# EAGLE design TXn_v1.2_bottomonly (EAGLE 8.6.2)
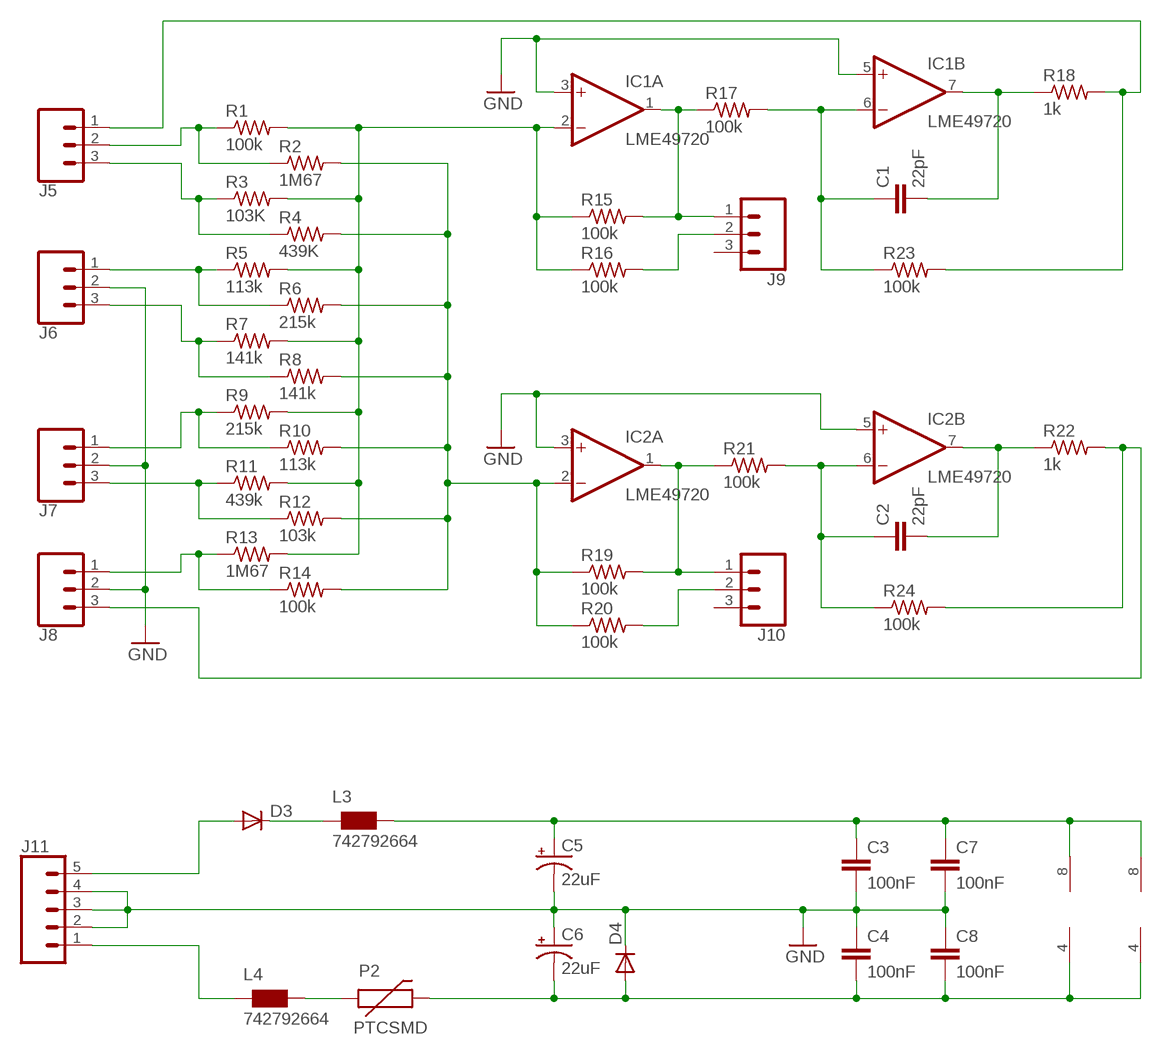
[diagram p0: schematic, sheet 1]

## Parts
C1  22pF  CAP0603-CAP  [0603-CAP]
C2  22pF  CAP0603-CAP  [0603-CAP]
C3  100nF  CAP0603-CAP  [0603-CAP]
C4  100nF  CAP0603-CAP  [0603-CAP]
C5  22uF  CPOL-USB  [PANASONIC_B]
C6  22uF  CPOL-USB  [PANASONIC_B]
C7  100nF  CAP0603-CAP  [0603-CAP]
C8  100nF  CAP0603-CAP  [0603-CAP]
D3  DIODE-SOD123  [SOD123]
D4  DIODE-SOD123  [SOD123]
IC1  LME49720  TL072D  [SO08]
IC2  LME49720  TL072D  [SO08]
J5  CONN_031X03_NO_SILK  [1X03_NO_SILK]
J6  CONN_031X03_NO_SILK  [1X03_NO_SILK]
J7  CONN_031X03_NO_SILK  [1X03_NO_SILK]
J8  CONN_031X03_NO_SILK  [1X03_NO_SILK]
J9  CONN_031X03_NO_SILK  [1X03_NO_SILK]
J10  CONN_031X03_NO_SILK  [1X03_NO_SILK]
J11  CONN_05NO_SILK  [1X05_NO_SILK]
L3  742792664  WE-CBF_0603  [0603]
L4  742792664  WE-CBF_0603  [0603]
P2  PTCSMD  [PTC-1206]
R1  100k  R-US_R0603  [R0603]
R2  1M67  R-US_R0603  [R0603]
R3  103K  R-US_R0603  [R0603]
R4  439K  R-US_R0603  [R0603]
R5  113k  R-US_R0603  [R0603]
R6  215k  R-US_R0603  [R0603]
R7  141k  R-US_R0603  [R0603]
R8  141k  R-US_R0603  [R0603]
R9  215k  R-US_R0603  [R0603]
R10  113k  R-US_R0603  [R0603]
R11  439k  R-US_R0603  [R0603]
R12  103k  R-US_R0603  [R0603]
R13  1M67  R-US_R0603  [R0603]
R14  100k  R-US_R0603  [R0603]
R15  100k  R-US_R0603  [R0603]
R16  100k  R-US_R0603  [R0603]
R17  100k  R-US_R0603  [R0603]
R18  1k  R-US_R0603  [R0603]
R19  100k  R-US_R0603  [R0603]
R20  100k  R-US_R0603  [R0603]
R21  100k  R-US_R0603  [R0603]
R22  1k  R-US_R0603  [R0603]
R23  100k  R-US_R0603  [R0603]
R24  100k  R-US_R0603  [R0603]

## Nets
BMIX: IC2.2(A:-IN) R2.2 R4.2 R6.2 R8.2 R10.2 R12.2 R14.2 R19.1 R20.1
BOUT: J8.3 R22.2 R24.2
GND: C3.2 C4.1 C5.- C6.+ C7.2 C8.1 D4.C IC1.3(A:+IN) IC1.5(B:+IN) IC2.3(A:+IN) IC2.5(B:+IN) J6.2 J7.2 J8.2 J11.2 J11.3 J11.4
N$3: J5.2 R1.1 R2.1
N$4: J5.3 R3.1 R4.1
N$5: J6.1 R5.1 R6.1
N$6: J6.3 R7.1 R8.1
N$7: J7.3 R11.1 R12.1
N$8: J8.1 R13.1 R14.1
N$10: J7.1 R9.1 R10.1
N$18: IC2.1(A:OUT) J10.1 R19.2 R21.1
N$21: C2.1 IC2.6(B:-IN) R21.2 R24.1
N$23: IC1.1(A:OUT) J9.1 R15.2 R17.1
N$24: C1.1 IC1.6(B:-IN) R17.2 R23.1
N$25: C2.2 IC2.7(B:OUT) R22.1
N$26: J9.2 R16.2
N$27: C1.2 IC1.7(B:OUT) R18.1
N$30: J10.2 R20.2
N$33: D3.C L3.1
N$34: L4.2 P2.1
TMIX: IC1.2(A:-IN) R1.2 R3.2 R5.2 R7.2 R9.2 R11.2 R13.2 R15.1 R16.1
TOUT: J5.1 R18.2 R23.2
VCC: C3.1 C5.+ C7.1 IC1.8(P:V+) IC2.8(P:V+) L3.2
VCC1: D3.A J11.5
VEE: C4.2 C6.- C8.2 D4.A IC1.4(P:V-) IC2.4(P:V-) P2.2
VEE1: J11.1 L4.1
Unconnected: J9.3 J10.3

## Library data of the parts
C1-C4 C7 C8 = SparkFun-Passives:CAP: Capacitor Standard 0603 ceramic capacitor, and 0.1" leaded capacitor.
C5 C6 = rcl:CPOL-US: POLARIZED CAPACITOR, American symbol; SPICEPREFIX: C
D3 D4 = diode:DIODE-: DIODE
IC1 = linear:TL072: OP AMP; SPICEPREFIX: J
IC2 = linear:TL072: OP AMP
J5-J10 = SparkFun-Connectors:CONN_03: Header 3 Standard 3-pin 0.1" header. Use with straight break away headers (SKU : PRT-00116), right angle break away headers (PRT-00553), swiss pins (PRT-00743), machine pins (PRT-00117), and female headers (PRT-00115). Molex polarized connector foot print use with SKU : PRT-08232 with associated crimp pins and housings.
J11 = SparkFun-Connectors:CONN_05: Header 5 Standard 5-pin 0.1" header. Use with straight break away headers (SKU : PRT-00116), right angle break away headers (PRT-00553), swiss pins (PRT-00743), machine pins (PRT-00117), and female headers (PRT-00115). Molex polarized connector foot print use with SKU : PRT-08230 with associated crimp pins and housings.
L3 L4 = wuerth-elektronik:WE-CBF: SMD EMI Suppression Ferrite Beads - excellent anti-EMI properties - low DCR - impedances till 3000 ohms - rated current up to 6 A
P2 = SparkFun:PTC: Resettable Fuse PTC Resettable Fuse. Spark Fun Electronics SKU : COM-08357
R1-R24 = adafruit:R-US_: RESISTOR, American symbol

## Board
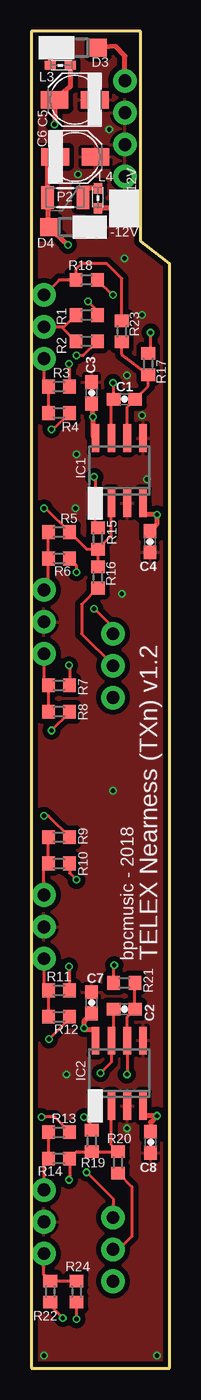
[diagram p1: board, top side]
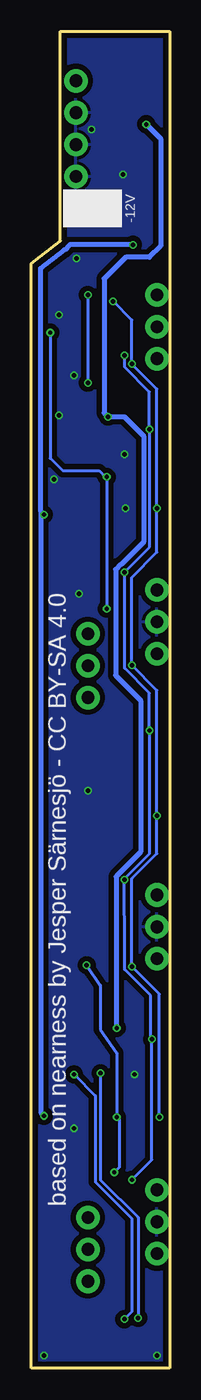
[diagram p2: board, bottom side, seen from below]

Size 11 x 106.5 mm. Coordinates in mm from the lower left corner, seen from the top.
Outline: 0,0 11,0 11,88 8.7,89.8 8.7,106.5 0,106.5 0,0
Copper layers (1*16): Top 0.035559375mm / dielectric 1.6mm / Bottom 0.035559375mm
Design rules "oshpark-2layer": minimum track width 6mil, minimum drill 10mil, track to track 6mil, track to pad 6mil, pad to pad 6mil, via to via 6mil, smd to smd 6mil, copper to edge 15mil, drill to drill 6mil, minimum pad ring 5mil, minimum via ring 5mil, stop-mask expansion 2.5mil, vias tented up to drill 0mil, thermal gap 10mil

### Footprints (pad centres in the part's own frame; a part is rotated, then mirrored left to right if it is on the bottom)
0603-CAP = smd 1.1 x 1: 1 -0.85,0; 2 0.85,0
PANASONIC_B = smd 2.2 x 1.4: + 1.6,0; - -1.6,0
SOD123 = smd 1.4 x 1.4: A 1.9,0; C -1.9,0
SO08 = smd 0.6 x 2.2: 1 -1.905,-2.6; 2 -0.635,-2.6; 3 0.635,-2.6; 4 1.905,-2.6; 5 1.905,2.6; 6 0.635,2.6; 7 -0.635,2.6; 8 -1.905,2.6
1X03_NO_SILK = drill 1.016 pad 1.88: 1 0,0; 2 2.54,0; 3 5.08,0
1X05_NO_SILK = drill 1.016 pad 1.88: 1 0,0; 2 2.54,0; 3 5.08,0; 4 7.62,0; 5 10.16,0
0603 = smd 0.85 x 0.7: 1 -0.9,0; 2 0.7,0
PTC-1206 = smd 1 x 1.8: 1 -1.4,0; 2 1.4,0
R0603 = smd 1 x 1.1: 1 -0.85,0; 2 0.85,0

### Placement (x,y rotation side)
C1  7.4,77.2 180 top
C2  7.4,28.6 180 top
C3  4.8,77.7 90 top
C4  9.45,65.85 90 top
C5  3.45,101.05 180 top
C6  3.5,96.5 0 top
C7  4.8,29.1 90 top
C8  9.5,18 90 top
D3  3.4,105.2 0 top
D4  3.3,90.9 180 top
IC1  7,71.5 0 top
IC2  7,23.5 0 top
J5  1,85.5 270 top
J6  1,62 270 top
J7  1,37.7 270 top
J8  1,14.2 270 top
J9  6.5,58.5 270 top
J10  6.5,12 270 top
J11  7.45,92.4 90 top
L3  2.4,103.8 0 top
L4  5.3,93.3 90 top
P2  2.7,93.25 180 top
R1  4.4,83.9 0 top
R2  4.4,81.8 0 top
R3  2.2,78.2 0 top
R4  2.2,76.1 0 top
R5  2.2,66.6 0 top
R6  2.2,64.5 0 top
R7  2.2,54.4 0 top
R8  2.2,52.3 0 top
R9  2.2,42.3 0 top
R10  2.2,40.2 0 top
R11  2.2,30.1 0 top
R12  2.2,28 0 top
R13  2.2,18.8 0 top
R14  2.2,16.7 0 top
R15  5.3,66.1 90 top
R16  5.3,63 270 top
R17  9.3,80 270 top
R18  4.4,86.7 180 top
R19  4.8,18.1 90 top
R20  6.9,16.4 270 top
R21  7.4,30.7 0 top
R22  1.5,6.1 90 top
R23  7.2,82.6 90 top
R24  3.6,6.1 90 top

### Tracks (layer width: path | path; a pad name or v marks a point on that pad's centre or on a via)
BMIX  (via drill 0.35)
  Top 0.254: v3,15 3.05,15.05 R14.2 3.6,17.25 R19.1 R20.1 6.37,17.79 IC2.2 | v1.4,26.2 3.05,27.85 R12.2 | R10.2 3.05,39.45 v3.6,38.9 | v1.6,50.8 3.05,52.25 R8.2 | v3.6,63.4 3.6,63.95 R6.2 | v1.6,74.8 1.75,74.8 R4.2 | v3.6,80.7 4.15,80.7 R2.2
  Bottom 0.254: v3,15 1.4,16.6 v1.4,26.2 1.5,26.3 1.5,29.68 3.58,31.76 3.58,33.18 v3.6,38.9 3.41,39.09 3.41,39.17 1.58,40.99 1.58,50.78 v1.6,50.8 1.6,53.78 3.58,55.76 3.58,63.42 | 3.58,63.42 3.5,63.5 | 3.58,63.42 v3.6,63.4 1.58,65.42 1.58,74.68 1.6,74.7 v1.6,74.8 1.6,77.78 3.58,79.76 3.58,80.68 v3.6,80.7
BOUT
  Top 0.254: R24.2 R22.2 1,7.45 J8.3
GND  (via drill 0.35)
  other vias: 10,1 1,1 6.2,98.7 7.4,88.4 7.6,79.1 8.8,75.9 6.5,46 3.5,68.5 8.8,83.9 3.6,72.8 9.2,70.8 7.2,61.7 3.7,95.1 7.6,19.1 2.8,23.4
  pour Top (isolate 0.406): 0,0 0,107 14,107 13,0
  pour Bottom (isolate 0.406): -1,0 -1,107 12,107 12,0
N$3
  Top 0.254: J5.2 2.39,82.96 | 2.39,82.96 R2.1 | 2.39,82.96 2.61,82.96 R1.1
N$4
  Top 0.254: J5.3 1,78.55 R3.1 R4.1
N$5
  Top 0.254: J6.1 1.35,62.35 R6.1 R5.1
N$6
  Top 0.254: J6.3 1,54.75 R7.1 R8.1
N$7
  Top 0.254: J7.3 1,30.45 R11.1 R12.1
N$8
  Top 0.254: J8.1 1,16.35 R14.1 R13.1
N$10
  Top 0.254: J7.1 1,39.85 R10.1 R9.1
N$18  (via drill 0.35)
  Top 0.254: R21.1 6.55,32.05 v6.6,32.1 | v4.2,20 4,20 | v4.2,20 5,20 5.09,20.09 IC2.1 | v4.2,20 4.8,19.4 R19.2 | v4.4,15.6 6.5,13.5 J10.1
  Bottom 0.254: v6.6,32.1 5.5,30.5 5.5,27 4.2,25.1 v4.2,20 4,19.8 4,16 v4.4,15.6
N$21  (via drill 0.35)
  Top 0.254: R21.2 C2.1 7.63,27.98 IC2.6 7.63,23.57 7.7,23.5 v7.6,23.4 | v3.6,3.9 R24.1
  Bottom 0.254: v7.6,23.4 5.91,21.71 5.91,14.83 3,11.93 3,4.5 v3.6,3.9
N$23  (via drill 0.35)
  Top 0.254: R17.1 9.5,81.05 v9.5,82.5 | v5,71 5.09,70.91 IC1.1 5.09,67.16 R15.2 | v5,60.5 6.5,59 J9.1
  Bottom 0.254: v9.5,82.5 9.5,72.5 8.5,71.5 5.6,71.5 5.1,71 v5,71 v5,60.5
N$24
  Top 0.254: IC1.6 7.63,76.58 C1.1 9.3,78.25 R17.2 7.2,80.75 R23.1
N$25  (via drill 0.35)
  Top 0.254: C2.2 6.55,26.29 IC2.7 6.37,24.36 v5.5,23.5 | v2.5,4 1.5,5 R22.1
  Bottom 0.254: v5.5,23.5 5.5,15 2.5,12 v2.5,4
N$26
  Top 0.254: R16.2 4,60.85 4,58.5 6.5,56 J9.2
N$27  (via drill 0.35)
  Top 0.254: IC1.7 6.37,77.02 6.5,77.15 | 6.5,77.15 C1.2 | R18.1 6.5,85.45 v6.5,85.5 | v6.5,78.5 6.5,77.15
  Bottom 0.254: v6.5,85.5 v6.5,78.5
N$30
  Top 0.254: R20.2 8,14.45 8,10.5 6.96,9.46 J10.2
N$33
  Top 0.406: D3.C L3.1
N$34
  Top 0.406: L4.2 4,94 4,93.35 P2.1
TMIX  (via drill 0.35)
  Top 0.254: R13.2 1.85,20 v0.81,20 | v3,32 3,30.15 R11.2 | v1,44 1.35,44 R9.2 | v3,56 3.05,55.95 R7.2 | v1,68.5 1.15,68.5 R5.2 4.4,65.25 R15.1 | v3,80 3,78.25 R3.2 | v4.5,85 5.25,84.25 R1.2 | R15.1 6.37,66.31 IC1.2 | R15.1 R16.1
  Bottom 0.254: v0.81,20 0.81,29.81 v3,32 3,39 1,41 v1,44 1,54 v3,56 3,63 1,65 v1,68.5 1,78 v3,80 3,83.5 v4.5,85
TOUT
  Top 0.254: R23.2 7.2,86.8 6,88 4,88 3.55,87.55 R18.2 2.2,86.7 J5.1
VCC  (via drill 0.35)
  Top 0.406: L3.2 3.1,102.1 C5.+ v1.85,99.1 1.8,99.1 | C3.1 4.9,76.75 v4.9,75.8 4.9,74.3 IC1.8 | C7.1 4.2,27.65 v4.2,27.1 4.3,27 5,27 5.09,26.91 IC2.8
  Bottom 0.406: v1.85,99.1 0.71,97.96 0.71,89.4 1.61,88.5 3.5,88.5 5.2,86.8 5.2,76.1 v4.9,75.8 3.6,75.8 2.06,74.26 2.06,65.8 3.81,64.06 3.87,64.06 4.3,63.63 4.3,55.2 2.3,53.2 2.3,41.13 4.26,39.17 4.26,27.14 4.3,27.1 v4.2,27.1
VCC1
  Top 0.406: J11.5 7.45,104.55 6.7,105.3 D3.A
VEE  (via drill 0.35)
  Top 0.406: C6.- 1.3,95.9 P2.2 1.3,91 D4.A v2.9,89.5 | IC1.4 9,68.81 9,68 v10,68 10,67.25 C4.2 | IC2.4 8.9,20.09 9,20 9.1,20.1 v10,20.1 9.5,19.6 C8.2
  Bottom 0.406: v2.9,89.5 7.95,89.5 8.36,89.09 8.39,89.09 10.29,87.6 10.29,68.29 10.25,68.25 | 10.25,68.25 v10,68 | 10.25,68.25 10.25,20.35 v10,20.1
VEE1
  Top 0.406: J11.1 L4.1

### Text on the board
tNames: -12V | -12V | bpcmusic - 2018 | TELEX Nearness (TXn) v1.2
bNames: -12V | based on nearness by Jesper Särnesjö - CC BY-SA 4.0